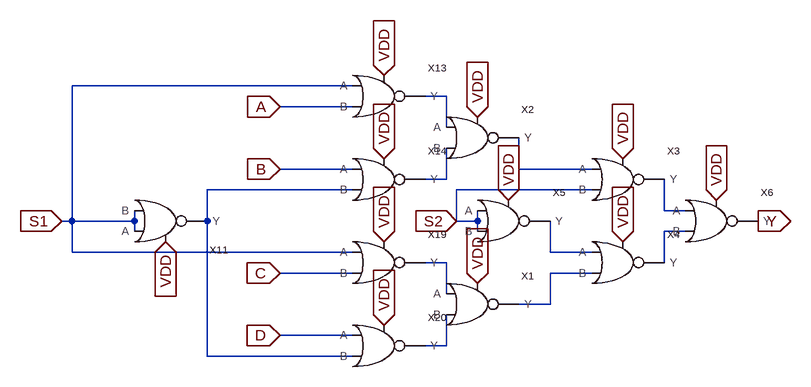
[diagram p0: schematic mux4to1.asc]
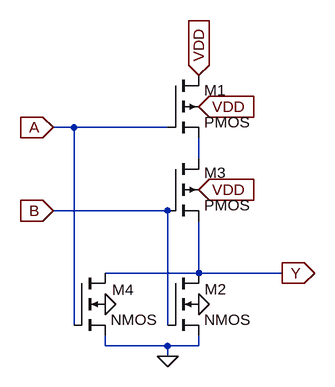
[diagram p1: sub-circuit nor.asc]
mux4to1.asc, the LTspice schematic file:
Version 4
SHEET 1 880 744
WIRE -128 -80 -560 -80
WIRE 16 -64 -16 -64
WIRE -128 -48 -240 -48
WIRE 16 -16 16 -64
WIRE -128 48 -240 48
WIRE 128 48 128 0
WIRE 240 48 128 48
WIRE 16 64 16 16
WIRE 16 64 -16 64
WIRE -128 80 -352 80
WIRE 240 80 32 80
WIRE 352 112 352 64
WIRE 384 112 352 112
WIRE -560 128 -560 -80
WIRE -560 128 -576 128
WIRE -464 128 -464 112
WIRE -464 128 -560 128
WIRE -352 128 -352 80
WIRE 32 128 32 80
WIRE 64 128 64 112
WIRE 64 128 32 128
WIRE -464 144 -464 128
WIRE 64 144 64 128
WIRE 384 144 352 144
WIRE -560 176 -560 128
WIRE -128 176 -560 176
WIRE 176 176 176 128
WIRE 240 176 176 176
WIRE 16 192 -16 192
WIRE 352 192 352 144
WIRE -128 208 -240 208
WIRE 240 208 176 208
WIRE 16 240 16 192
WIRE 176 256 176 208
WIRE 176 256 128 256
WIRE -128 304 -240 304
WIRE 16 320 16 272
WIRE 16 320 -16 320
WIRE -352 336 -352 128
WIRE -128 336 -352 336
FLAG -576 128 S1
IOPIN -576 128 In
FLAG 32 128 S2
IOPIN 32 128 In
FLAG -240 -48 A
IOPIN -240 -48 In
FLAG -240 48 B
IOPIN -240 48 In
FLAG -240 208 C
IOPIN -240 208 In
FLAG -240 304 D
IOPIN -240 304 In
FLAG -80 -96 VDD
IOPIN -80 -96 In
FLAG -80 32 VDD
IOPIN -80 32 In
FLAG -80 160 VDD
IOPIN -80 160 In
FLAG -80 288 VDD
IOPIN -80 288 In
FLAG -416 160 VDD
IOPIN -416 160 In
FLAG 64 -32 VDD
IOPIN 64 -32 In
FLAG 112 96 VDD
IOPIN 112 96 In
FLAG 64 224 VDD
IOPIN 64 224 In
FLAG 288 32 VDD
IOPIN 288 32 In
FLAG 288 160 VDD
IOPIN 288 160 In
FLAG 432 96 VDD
IOPIN 432 96 In
FLAG 496 128 Y
IOPIN 496 128 Out
SYMBOL NOR -432 128 M180
SYMATTR InstName X11
SYMBOL NOR -96 -64 R0
SYMATTR InstName X13
SYMBOL NOR -96 64 R0
SYMATTR InstName X14
SYMBOL NOR -96 192 R0
SYMATTR InstName X19
SYMBOL NOR -96 320 R0
SYMATTR InstName X20
SYMBOL NOR 48 256 R0
SYMATTR InstName X1
SYMBOL NOR 48 0 R0
SYMATTR InstName X2
SYMBOL NOR 272 64 R0
SYMATTR InstName X3
SYMBOL NOR 272 192 R0
SYMATTR InstName X4
SYMBOL NOR 96 128 R0
SYMATTR InstName X5
SYMBOL NOR 416 128 R0
SYMATTR InstName X6

nor.asc, the sub-circuit schematic file:
Version 4
SHEET 1 880 856
WIRE 16 368 -16 368
WIRE 160 368 16 368
WIRE 208 416 208 384
WIRE 160 496 -16 496
WIRE 208 592 208 512
WIRE 208 592 64 592
WIRE 336 592 208 592
WIRE 16 672 16 368
WIRE 160 672 160 496
WIRE 64 704 64 688
WIRE 160 704 64 704
WIRE 208 704 208 688
WIRE 208 704 160 704
WIRE 160 720 160 704
FLAG 160 720 0
FLAG 208 640 0
FLAG 64 640 0
FLAG -16 368 A
IOPIN -16 368 In
FLAG -16 496 B
IOPIN -16 496 In
FLAG 208 464 VDD
IOPIN 208 464 In
FLAG 208 336 VDD
IOPIN 208 336 In
FLAG 208 288 VDD
IOPIN 208 288 In
FLAG 336 592 Y
IOPIN 336 592 Out
SYMBOL nmos4 160 592 R0
WINDOW 0 57 25 Left 2
SYMATTR InstName M2
SYMATTR Value2 l=90n w=200n
SYMBOL nmos4 16 592 R0
WINDOW 0 59 26 Left 2
SYMATTR InstName M4
SYMATTR Value2 l=90n w=200n
SYMBOL pmos4 160 288 R0
WINDOW 0 56 23 Left 2
SYMATTR InstName M1
SYMATTR Value2 l=90n w=400n
SYMBOL pmos4 160 416 R0
WINDOW 0 56 22 Left 2
SYMATTR InstName M3
SYMATTR Value2 l=90n w=400n

The netlist it stands for:
* mux4to1.asc
XX11 S1 S1 N004 VDD nor
XX13 S1 A N001 VDD nor
XX14 B N004 N003 VDD nor
XX19 S1 C N008 VDD nor
XX20 D N004 N010 VDD nor
XX1 N008 N010 N009 VDD nor
XX2 N001 N003 N002 VDD nor
XX3 N002 S2 N005 VDD nor
XX4 N007 N009 N006 VDD nor
XX5 S2 S2 N007 VDD nor
XX6 N005 N006 Y VDD nor

* block symbol definitions
.subckt nor A B Y VDD
M2 Y B 0 0 NMOS l=90n w=200n
M4 Y A 0 0 NMOS l=90n w=200n
M1 VDD A N001 VDD PMOS l=90n w=400n
M3 N001 B Y VDD PMOS l=90n w=400n
.ends nor

.model NMOS NMOS
.model PMOS PMOS
.lib standard.mos
.backanno
.end